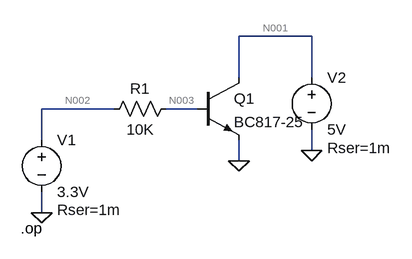
[diagram p0: schematic calculo corrente bc337.asc]
calculo corrente bc337.asc, the LTspice schematic file:
Version 4
SHEET 1 880 680
WIRE 528 -32 416 -32
WIRE 416 32 416 -32
WIRE 528 32 528 -32
WIRE 224 80 112 80
WIRE 352 80 304 80
WIRE 112 128 112 80
WIRE 528 144 528 112
WIRE 416 160 416 128
WIRE 112 240 112 208
FLAG 112 240 0
FLAG 416 160 0
FLAG 528 144 0
SYMBOL voltage 112 112 R0
WINDOW 123 0 0 Left 2
WINDOW 39 24 124 Left 2
SYMATTR SpiceLine Rser=1m
SYMATTR InstName V1
SYMATTR Value 3.3V
SYMBOL res 320 64 R90
WINDOW 0 0 56 VBottom 2
WINDOW 3 32 56 VTop 2
SYMATTR InstName R1
SYMATTR Value 10K
SYMATTR SpiceLine tol=1 pwr=0.1
SYMBOL npn 352 32 R0
SYMATTR InstName Q1
SYMATTR Value BC817-25
SYMBOL voltage 528 16 R0
WINDOW 123 0 0 Left 2
WINDOW 39 24 124 Left 2
SYMATTR SpiceLine Rser=1m
SYMATTR InstName V2
SYMATTR Value 5V
TEXT 80 264 Left 2 !.op

The netlist it stands for:
* calculo corrente bc337.asc
V1 N002 0 3.3V Rser=1m
R1 N003 N002 10K tol=1 pwr=0.1
Q1 N001 N003 0 0 BC817-25
V2 N001 0 5V Rser=1m
.model NPN NPN
.model PNP PNP
.lib standard.bjt
.op
.backanno
.end

* Results of the author's LTspice run, read from the files saved beside the schematic
* Operating Point:
*   V(n002) = 3.3 V
*   V(n003) = 731.9 mV
*   V(n001) = 5 V
*   Ic(Q1) = 76.24 mA
*   Ib(Q1) = 256.8 µA
*   Ie(Q1) = -76.5 mA
*   I(R1) = -256.8 µA
*   I(V2) = -76.24 mA
*   I(V1) = -256.8 µA
* From the log:
*   Semiconductor Device Operating Points:
*                           --- Bipolar Transistors ---
*   Name:       q1
*   Model:   bc817-25
*   Ib:       2.57e-04
*   Ic:       7.62e-02
*   Vbe:      7.32e-01
*   Vbc:     -4.27e+00
*   Vce:      5.00e+00
*   BetaDC:   2.97e+02
*   Gm:       2.59e+00
*   Rpi:      1.01e+02
*   Rx:       1.00e+00
*   Ro:       1.43e+03
*   Cbe:      1.54e-09
*   Cbc:      2.26e-12
*   Cjs:      0.00e+00
*   BetaAC:   2.62e+02
*   Cbx:      2.70e-12
*   Ft:       2.66e+08